# Altium schematic sheet STM32H743 MCU.SchDoc: Ornihopter Kamera Kartı
size A3; CompanyName: Erü EEM; Engineer: Berat Bayram; Address1: https://www.linkedin.com/in/beratbayram-eee/; DocumentNumber: OKK_1; Revision: V1; SheetNumber: 4; SheetTotal: 5
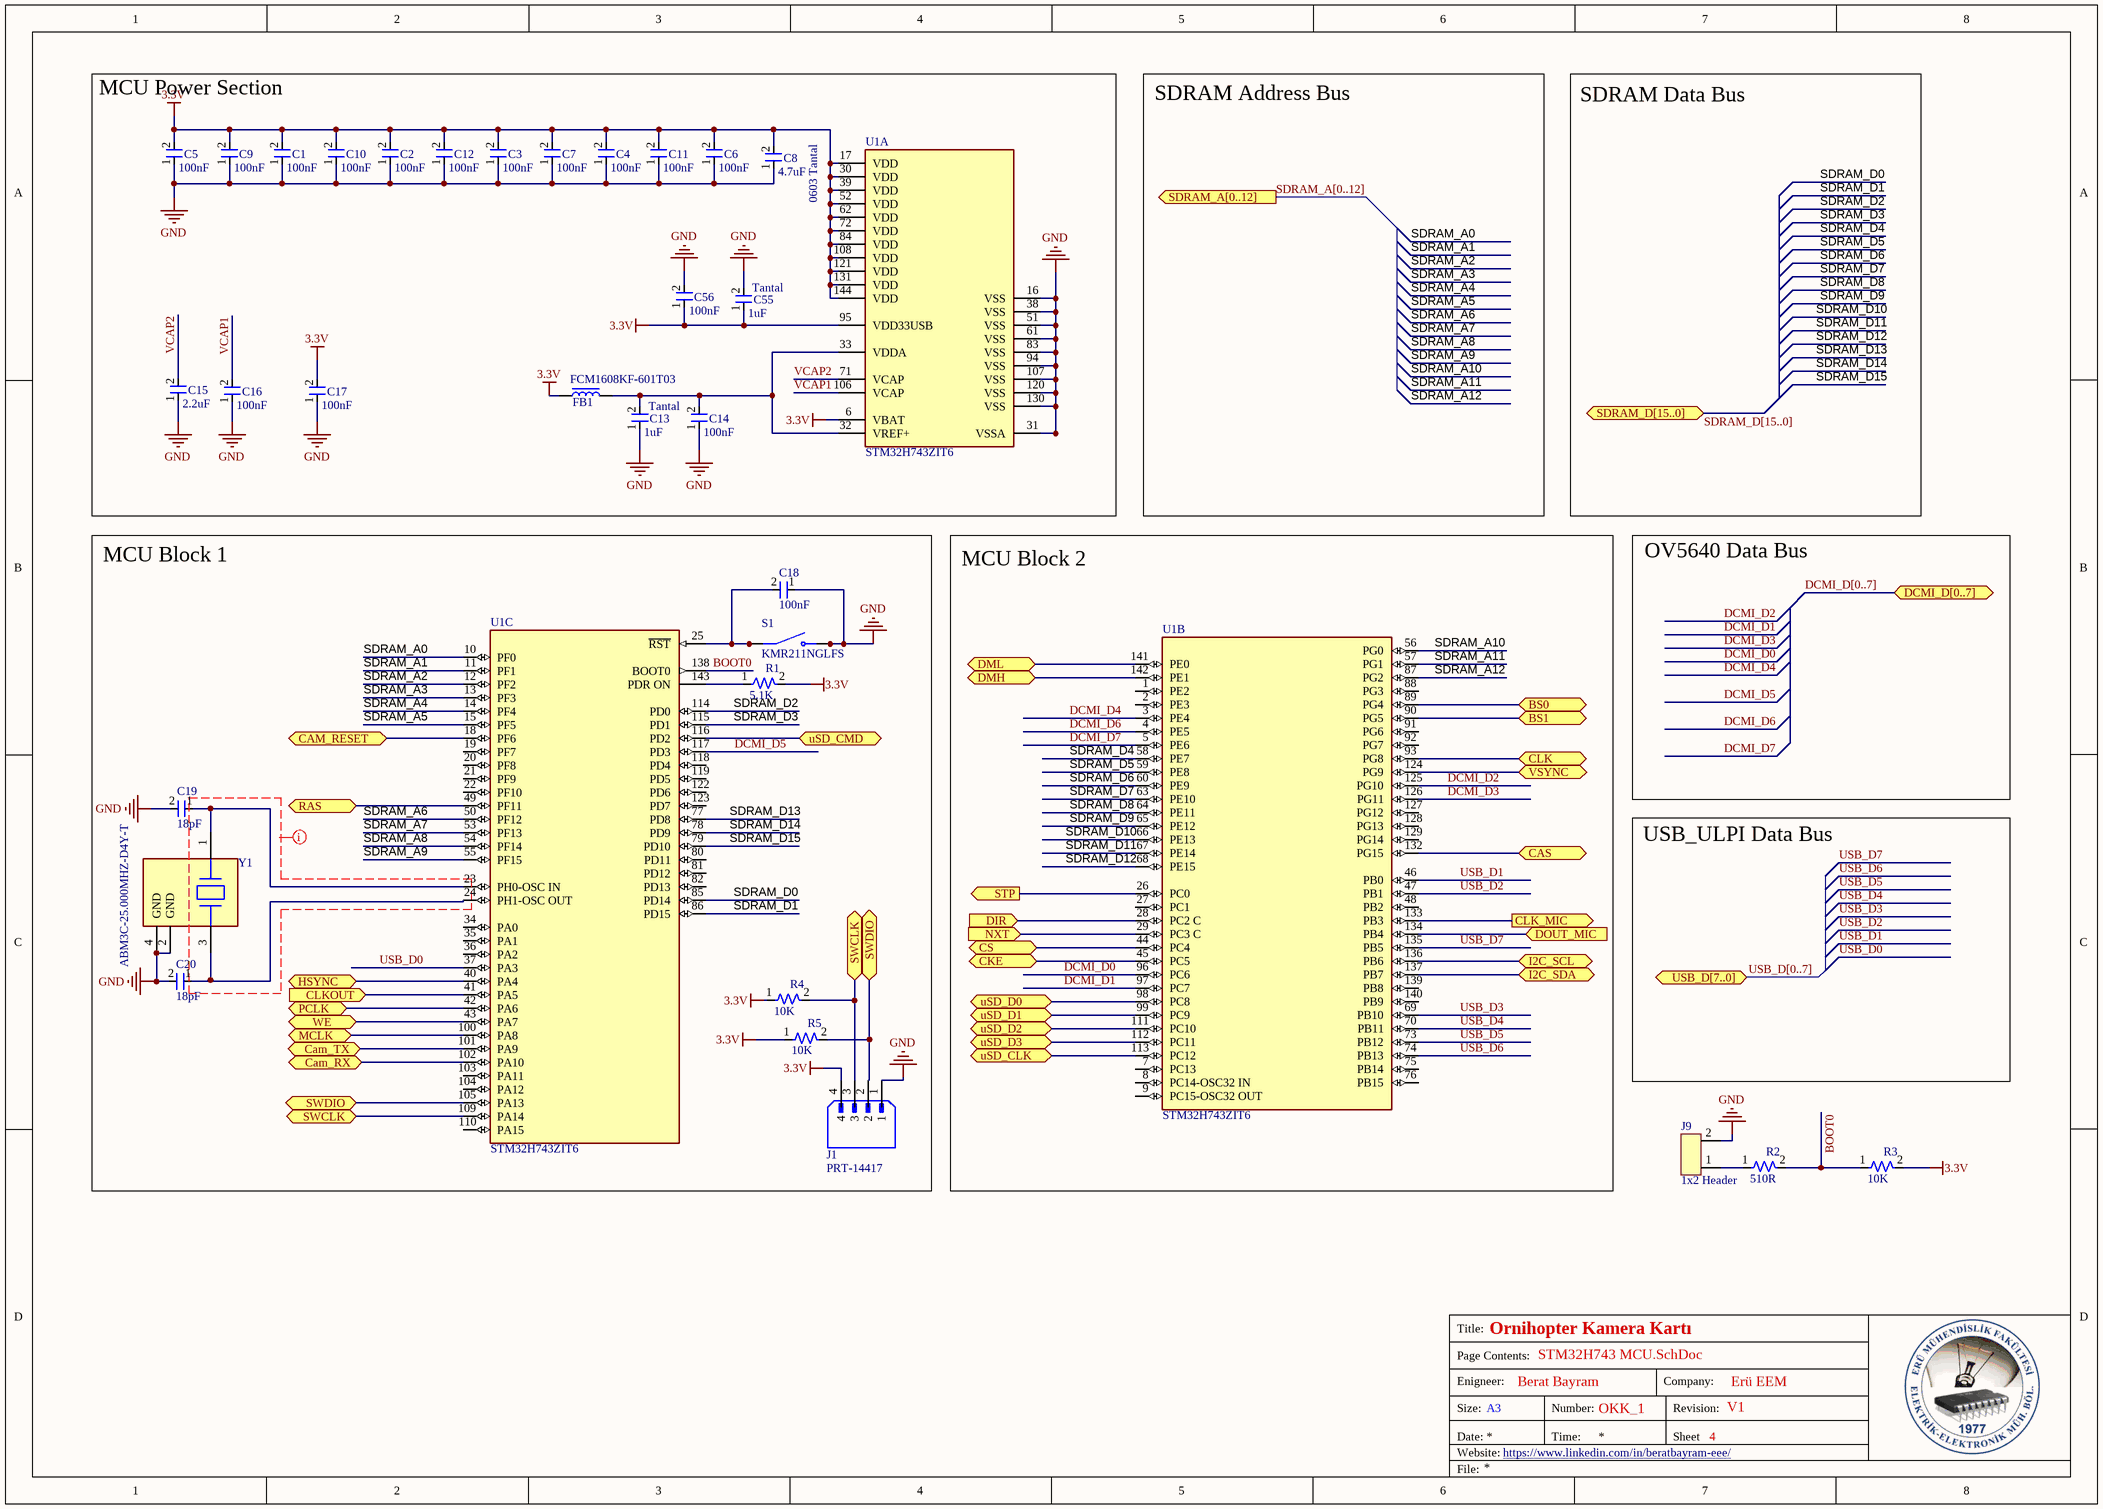
[diagram p0: STM32H743 MCU.SchDoc]

## Parts
C1  C: 100nF  [0603 Cap]  (hidden comment: 0603)
C2  C: 100nF  [0603 Cap]  (hidden comment: 0603)
C3  C: 100nF  [0603 Cap]  (hidden comment: 0603)
C4  C: 100nF  [0603 Cap]  (hidden comment: 0603)
C5  C: 100nF  [0603 Cap]  (hidden comment: 0603)
C6  C: 100nF  [0603 Cap]  (hidden comment: 0603)
C7  C: 100nF  [0603 Cap]  (hidden comment: 0603)
C8  0603 Tantal  C: 4.7uF  [0603 Cap]
C9  C: 100nF  [0603 Cap]  (hidden comment: 0603)
C10  C: 100nF  [0603 Cap]  (hidden comment: 0603)
C11  C: 100nF  [0603 Cap]  (hidden comment: 0603)
C12  C: 100nF  [0603 Cap]  (hidden comment: 0603)
C13  Tantal  C: 1uF  [0603 Cap]
C14  C: 100nF  [0603 Cap]  (hidden comment: 0603)
C15  C: 2.2uF  [0603 Cap]  (hidden comment: 0603)
C16  C: 100nF  [0603 Cap]  (hidden comment: 0603)
C17  C: 100nF  [0603 Cap]  (hidden comment: 0603)
C18  C: 100nF  [0603 Cap]  (hidden comment: 0603)
C19  C: 18pF  [0603 Cap]  (hidden comment: 0603)
C20  C: 18pF  [0603 Cap]  (hidden comment: 0603)
C55  Tantal  C: 1uF  [0603 Cap]
C56  C: 100nF  [0603 Cap]  (hidden comment: 0603)
FB1  FCM1608KF-601T03  [FB_0603]
J1  PRT-14417  [SPARKFUN_PRT-14417]
J9  1x2 Header  [1x2 Header]
R1  R: 5.1K  [0603 Res]  (hidden comment: 0603)
R2  R: 510R  [0603 Res]  (hidden comment: 0603)
R3  R: 10K  [0603 Res]  (hidden comment: 0603)
R4  R: 10K  [0603 Res]  (hidden comment: 0603)
R5  R: 10K  [0603 Res]  (hidden comment: 0603)
S1  KMR211NGLFS  [SW_KMR211NGLFS]
U1  STM32H743ZIT6  [FP-LQFP144-1A-MFG]  (parts A,B,C of 3)
Y1  ABM3C-25.000MHZ-D4Y-T  [FP-ABM3C-MFG]

## Blocks framed on the sheet
MCU Power Section: C1-C17 C55 C56 FB1 U1
MCU Block 1: C18-C20 J1 R1 R4 R5 S1 U1 Y1
MCU Block 2: U1

## Ports
BS0 (bidir, see External SDRAM[2C]), BS1 (bidir, see External SDRAM[2C]), CAM_RESET (bidir, see OV5640 Camera[3C]), Cam_RX (bidir, see Microphone-Other Parts[6D]), Cam_TX (bidir, see Microphone-Other Parts[6D]), CAS (bidir, see External SDRAM[2B]), CKE (bidir, see External SDRAM[2B]), CLK (bidir, see External SDRAM[2B]), CLK_MIC (out, see Microphone-Other Parts[5A]), CLKOUT (in, see Microphone-Other Parts[2D]), CS (bidir, see External SDRAM[2B]), DCMI_D[0..7] (bidir, see OV5640 Camera[3B]), DIR (in, see Microphone-Other Parts[4C]), DMH (bidir, see External SDRAM[2B]), DML (bidir, see External SDRAM[2B]), DOUT_MIC (in, see Microphone-Other Parts[5A]), HSYNC (bidir, see OV5640 Camera[3B]), I2C_SCL (bidir, see OV5640 Camera[3C]), I2C_SDA (bidir, see OV5640 Camera[3C]), MCLK (bidir, see OV5640 Camera[3B]), NXT (in, see Microphone-Other Parts[2D]), PCLK (bidir, see OV5640 Camera[3B]), RAS (bidir, see External SDRAM[2B]), SDRAM_A[0..12] (out, see External SDRAM[1A]), SDRAM_D[15..0] (bidir, see External SDRAM[3C]), STP (out, see Microphone-Other Parts[4C]), SWCLK (bidir, see STM32H743 MCU[2C]), SWCLK (bidir, see STM32H743 MCU[4C]), SWDIO (bidir, see STM32H743 MCU[2C]), SWDIO (bidir, see STM32H743 MCU[4C]), USB_D[7..0] (bidir, see Microphone-Other Parts[1C]), uSD_CLK (bidir, see Microphone-Other Parts[3A]), uSD_CMD (bidir, see Microphone-Other Parts[3A]), uSD_D0 (bidir, see Microphone-Other Parts[3A]), uSD_D1 (bidir, see Microphone-Other Parts[3A]), uSD_D2 (bidir, see Microphone-Other Parts[3A]), uSD_D3 (bidir, see Microphone-Other Parts[3A]), VSYNC (bidir, see OV5640 Camera[3C]), WE (bidir, see External SDRAM[2B])

## Nets
3.3V: C1.2 C2.2 C3.2 C4.2 C5.2 C6.2 C7.2 C8.2 C9.2 C10.2 C11.2 C12.2 C17.2 C55.1 C56.1 FB1.1 J1.4 R1.2 R3.2 R4.1 R5.1 U1.6(VBAT) U1.17(VDD) U1.30(VDD) U1.39(VDD) U1.52(VDD) U1.62(VDD) U1.72(VDD) U1.84(VDD) U1.95(VDD33USB) U1.108(VDD) U1.121(VDD) U1.131(VDD) U1.144(VDD)
GND: C1.1 C2.1 C3.1 C4.1 C5.1 C6.1 C7.1 C8.1 C9.1 C10.1 C11.1 C12.1 C13.1 C14.1 C15.1 C16.1 C17.1 C18.1 C19.2 C20.2 C55.2 C56.2 J1.1 J9.2 S1.3(NO) S1.4(NO) U1.16(VSS) U1.31(VSSA) U1.38(VSS) U1.51(VSS) U1.61(VSS) U1.83(VSS) U1.94(VSS) U1.107(VSS) U1.120(VSS) U1.130(VSS) Y1.2(GND) Y1.4(GND)
BOOT0: R2.2 R3.1 U1.138(BOOT0)
BS0: U1.89(PG4) ; port BS0
BS1: U1.90(PG5) ; port BS1
CAM_RESET: U1.18(PF6) ; port CAM_RESET
Cam_RX: U1.102(PA10) ; port Cam_RX
Cam_TX: U1.101(PA9) ; port Cam_TX
CAS: U1.132(PG15) ; port CAS
CKE: U1.45(PC5) ; port CKE
CLK: U1.93(PG8) ; port CLK
CLK_MIC: U1.133(PB3) ; port CLK_MIC
CLKOUT: U1.41(PA5) ; port CLKOUT
CS: U1.44(PC4) ; port CS
DCMI_D0: U1.96(PC6)
DCMI_D1: U1.97(PC7)
DCMI_D2: U1.125(PG10)
DCMI_D3: U1.126(PG11)
DCMI_D4: U1.3(PE4)
DCMI_D5: U1.117(PD3)
DCMI_D6: U1.4(PE5)
DCMI_D7: U1.5(PE6)
DIR: U1.28(PC2_C) ; port DIR
DMH: U1.142(PE1) ; port DMH
DML: U1.141(PE0) ; port DML
DOUT_MIC: U1.134(PB4) ; port DOUT_MIC
HSYNC: U1.40(PA4) ; port HSYNC
I2C_SCL: U1.136(PB6) ; port I2C_SCL
I2C_SDA: U1.137(PB7) ; port I2C_SDA
MCLK: U1.100(PA8) ; port MCLK
NXT: U1.29(PC3_C) ; port NXT
PCLK: U1.42(PA6) ; port PCLK
RAS: U1.49(PF11) ; port RAS
SDRAM_A0: U1.10(PF0)
SDRAM_A1: U1.11(PF1)
SDRAM_A2: U1.12(PF2)
SDRAM_A3: U1.13(PF3)
SDRAM_A4: U1.14(PF4)
SDRAM_A5: U1.15(PF5)
SDRAM_A6: U1.50(PF12)
SDRAM_A7: U1.53(PF13)
SDRAM_A8: U1.54(PF14)
SDRAM_A9: U1.55(PF15)
SDRAM_A10: U1.56(PG0)
SDRAM_A11: U1.57(PG1)
SDRAM_A12: U1.87(PG2)
SDRAM_D0: U1.85(PD14)
SDRAM_D1: U1.86(PD15)
SDRAM_D2: U1.114(PD0)
SDRAM_D3: U1.115(PD1)
SDRAM_D4: U1.58(PE7)
SDRAM_D5: U1.59(PE8)
SDRAM_D6: U1.60(PE9)
SDRAM_D7: U1.63(PE10)
SDRAM_D8: U1.64(PE11)
SDRAM_D9: U1.65(PE12)
SDRAM_D10: U1.66(PE13)
SDRAM_D11: U1.67(PE14)
SDRAM_D12: U1.68(PE15)
SDRAM_D13: U1.77(PD8)
SDRAM_D14: U1.78(PD9)
SDRAM_D15: U1.79(PD10)
STP: U1.26(PC0) ; port STP
SWCLK: J1.3 R4.2 U1.109(PA14) ; port SWCLK
SWDIO: J1.2 R5.2 U1.105(PA13) ; port SWDIO
USB_D0: U1.37(PA3)
USB_D1: U1.46(PB0)
USB_D2: U1.47(PB1)
USB_D3: U1.69(PB10)
USB_D4: U1.70(PB11)
USB_D5: U1.73(PB12)
USB_D6: U1.74(PB13)
USB_D7: U1.135(PB5)
uSD_CLK: U1.113(PC12) ; port uSD_CLK
uSD_CMD: U1.116(PD2) ; port uSD_CMD
uSD_D0: U1.98(PC8) ; port uSD_D0
uSD_D1: U1.99(PC9) ; port uSD_D1
uSD_D2: U1.111(PC10) ; port uSD_D2
uSD_D3: U1.112(PC11) ; port uSD_D3
VCAP1: C16.2 U1.106(VCAP)
VCAP2: C15.2 U1.71(VCAP)
VSYNC: U1.124(PG9) ; port VSYNC
WE: U1.43(PA7) ; port WE
NetC13_2: C13.2 C14.2 FB1.2 U1.32(VREF+) U1.33(VDDA)
NetC18_2: C18.2 S1.1(COM) S1.2(COM) U1.25(~{RST})
NetC19_1: C19.1 U1.23(PH0-OSC_IN) Y1.1
NetC20_1: C20.1 U1.24(PH1-OSC_OUT) Y1.3
NetJ9_1: J9.1 R2.1
NetR1_1: R1.1 U1.143(PDR_ON)

Not connected (* = marked no-connect by the designer): U1 1(PE2) 2(PE3) 7(PC13) 8(PC14-OSC32_IN) 9(PC15-OSC32_OUT) 19(PF7) 20(PF8) 21(PF9) 22(PF10) 27(PC1) 34(PA0) 35(PA1) 36(PA2) 48(PB2) 75(PB14) 76(PB15) 80(PD11) 81(PD12) 82(PD13) 88(PG3) 91(PG6) 92(PG7) 103(PA11) 104(PA12) 110(PA15) 118(PD4) 119(PD5) 122(PD6) 123(PD7) 127(PG12) 128(PG13) 129(PG14) 139(PB8) 140(PB9)

## Buses and harness runs
bus DCMI_D[0..7] = port DCMI_D[0..7]
bus SDRAM_A[0..12] = port SDRAM_A[0..12]
bus SDRAM_D[15..0] = port SDRAM_D[15..0]
bus USB_D[0..7] = port USB_D[7..0]

## Layout directives
net class OSC_NET: SDRAM_A6, SDRAM_A7, SDRAM_A8, SDRAM_A9, USB_D0

## Notes on the sheet
- SDRAM Address Bus
- SDRAM Data Bus
- OV5640 Data Bus
- USB_ULPI Data Bus
- Title:
- Enigneer:
- Page Contents:
- Company:
- Size:
- Date:
- File:
- Website:
- A3
- Number:
- Time:
- Revision:
- Sheet

## Library data of the parts
C1-C20 C55 C56 = 0603 Cap
FB1 = FB_0603: Ferrite Bead SMD 0603; Manufacturer: *; Manufacturer Part Number: *; Distributor Link: *; LCSC: *
J1 = PRT-14417: QWIIC JST CONNECTOR - SMD 4-PIN; MF: SparkFun Electronics; SnapEDA_Link: https://www.snapeda.com/parts/PRT-14417/SparkFun+Electronics/view-part/?ref=snap; Package: None; Value: *; MP: PRT-14417; Check_prices: https://www.snapeda.com/parts/PRT-14417/SparkFun+Electronics/view-part/?ref=eda
R1-R5 = 0603 Res
S1 = KMR211NGLFS: Tactile Switch SPST-NO Top Actuated Surface Mount; MF: C&K Components; MP: KMR211NGLFS; Value: *; Availability: Good; Package: None; Price: None; SnapEDA_Link: https://www.snapeda.com/parts/KMR211NGLFS/C&K%20Components/view-part/561579/?ref=snap; Check_prices: https://www.snapeda.com/parts/KMR211NGLFS/C&K%20Components/view-part/561579/?ref=eda; Purchase-URL: https://pricing.snapeda.com/search/part/KMR211NGLFS/?ref=eda
U1 = CMP-12105-000003-1: IC MCU 32BIT 2MB FLASH 144LQFP; Manufacturer: STMicroelectronics; Number Of I2C Channels: 4; Number Of A/D Converters: 2; Standoff Height: 0.05mm; Interface: I2C,SPI,UART,USART,EBI/EMI,CAN,USB,LIN,IrDA,Other; Max Supply Voltage: 3.6V; Number Of Adc Channels: 36; Ram Size: 1MBytes; Number Of Cores: 1; Frequency: 400MHz; Data Bus Width: 32bits; Core Architecture: ARM Cortex-M7; Memory Size: 2MBytes; Number Of Timers/Counters: 22; Min Supply Voltage: 1.62V; Number Of Spi Channels: 6; Max Junction Temp: +125°C; Number Of I/Os: 114; Digikey Description: IC MCU 32BIT 2MB FLASH 144LQFP; Device Class L2: Embedded Processors and Controllers; Number Of Usb Channels: 2; ComponentLink2Description: Datasheet; Ipc Land Pattern Name: QFP50P2200X2200X160-144; Category: IC; Lead Free: Yes; Temperature Range High: +85°C; Mouser Description: MCU 32-Bit STM32 ARM Cortex M7 RISC 2MB Flash 1.8V/2.5V/3.3V 144-Pin LQFP Tray; RoHS: TRUE; Ambient Temperature Range Low: -40°C; Temperature Range Low: -40°C; ComponentLink2URL: https://www.st.com/resource/en/datasheet/stm32h743zi.pdf; Ambient Temperature Range High: +85°C; Octopart: https://octopart.com/stm32h743zit6-stmicroelectronics-76372529; Number Of Pwm Channels: 2; Height: 1.6mm; Manufacturer Part Number: STM32H743ZIT6; Device Class L3: Microcontrollers; Device Class L1: Integrated Circuits (ICs); Automotive: No; Memory Type: FLASH; Number Of Uart Channels: 4; Package: LQFP144-1A; Temperature: -40°C to +85°C
Y1 = CMP-27762-007794-1: Crystal 25MHz ±30ppm 18pF SMD-4 5mm x 3.2mm; ESR (Equivalent Series Resistance): 50R; Frequency Tolerance: 30ppm; Case/Package: SMD/SMT; Packaging: Tape and Reel; Height: 0.051inch; Mount: Surface Mount; Termination: SMD/SMT; Max Operating Temperature: 85°C; RoHS Compliant: Yes; Tolerance: 30ppm; Number of Pins: 4; Lead Free: Lead Free; Package Quantity: 1000; Frequency Stability: 30ppm; Operating Frequency: 25 MHz; Depth: 3.2mm; Load Capacitance: 18pF; Resistor Type: Ceramic; Frequency: 25MHz; Width: 0.126inch; Series: ABM3C; Length: 5mm; Min Operating Temperature: -40°C; Radiation Hardening: No